# Altium schematic sheet FMTrans.SchDoc
size A3; SheetNumber: 1; SheetTotal: 1
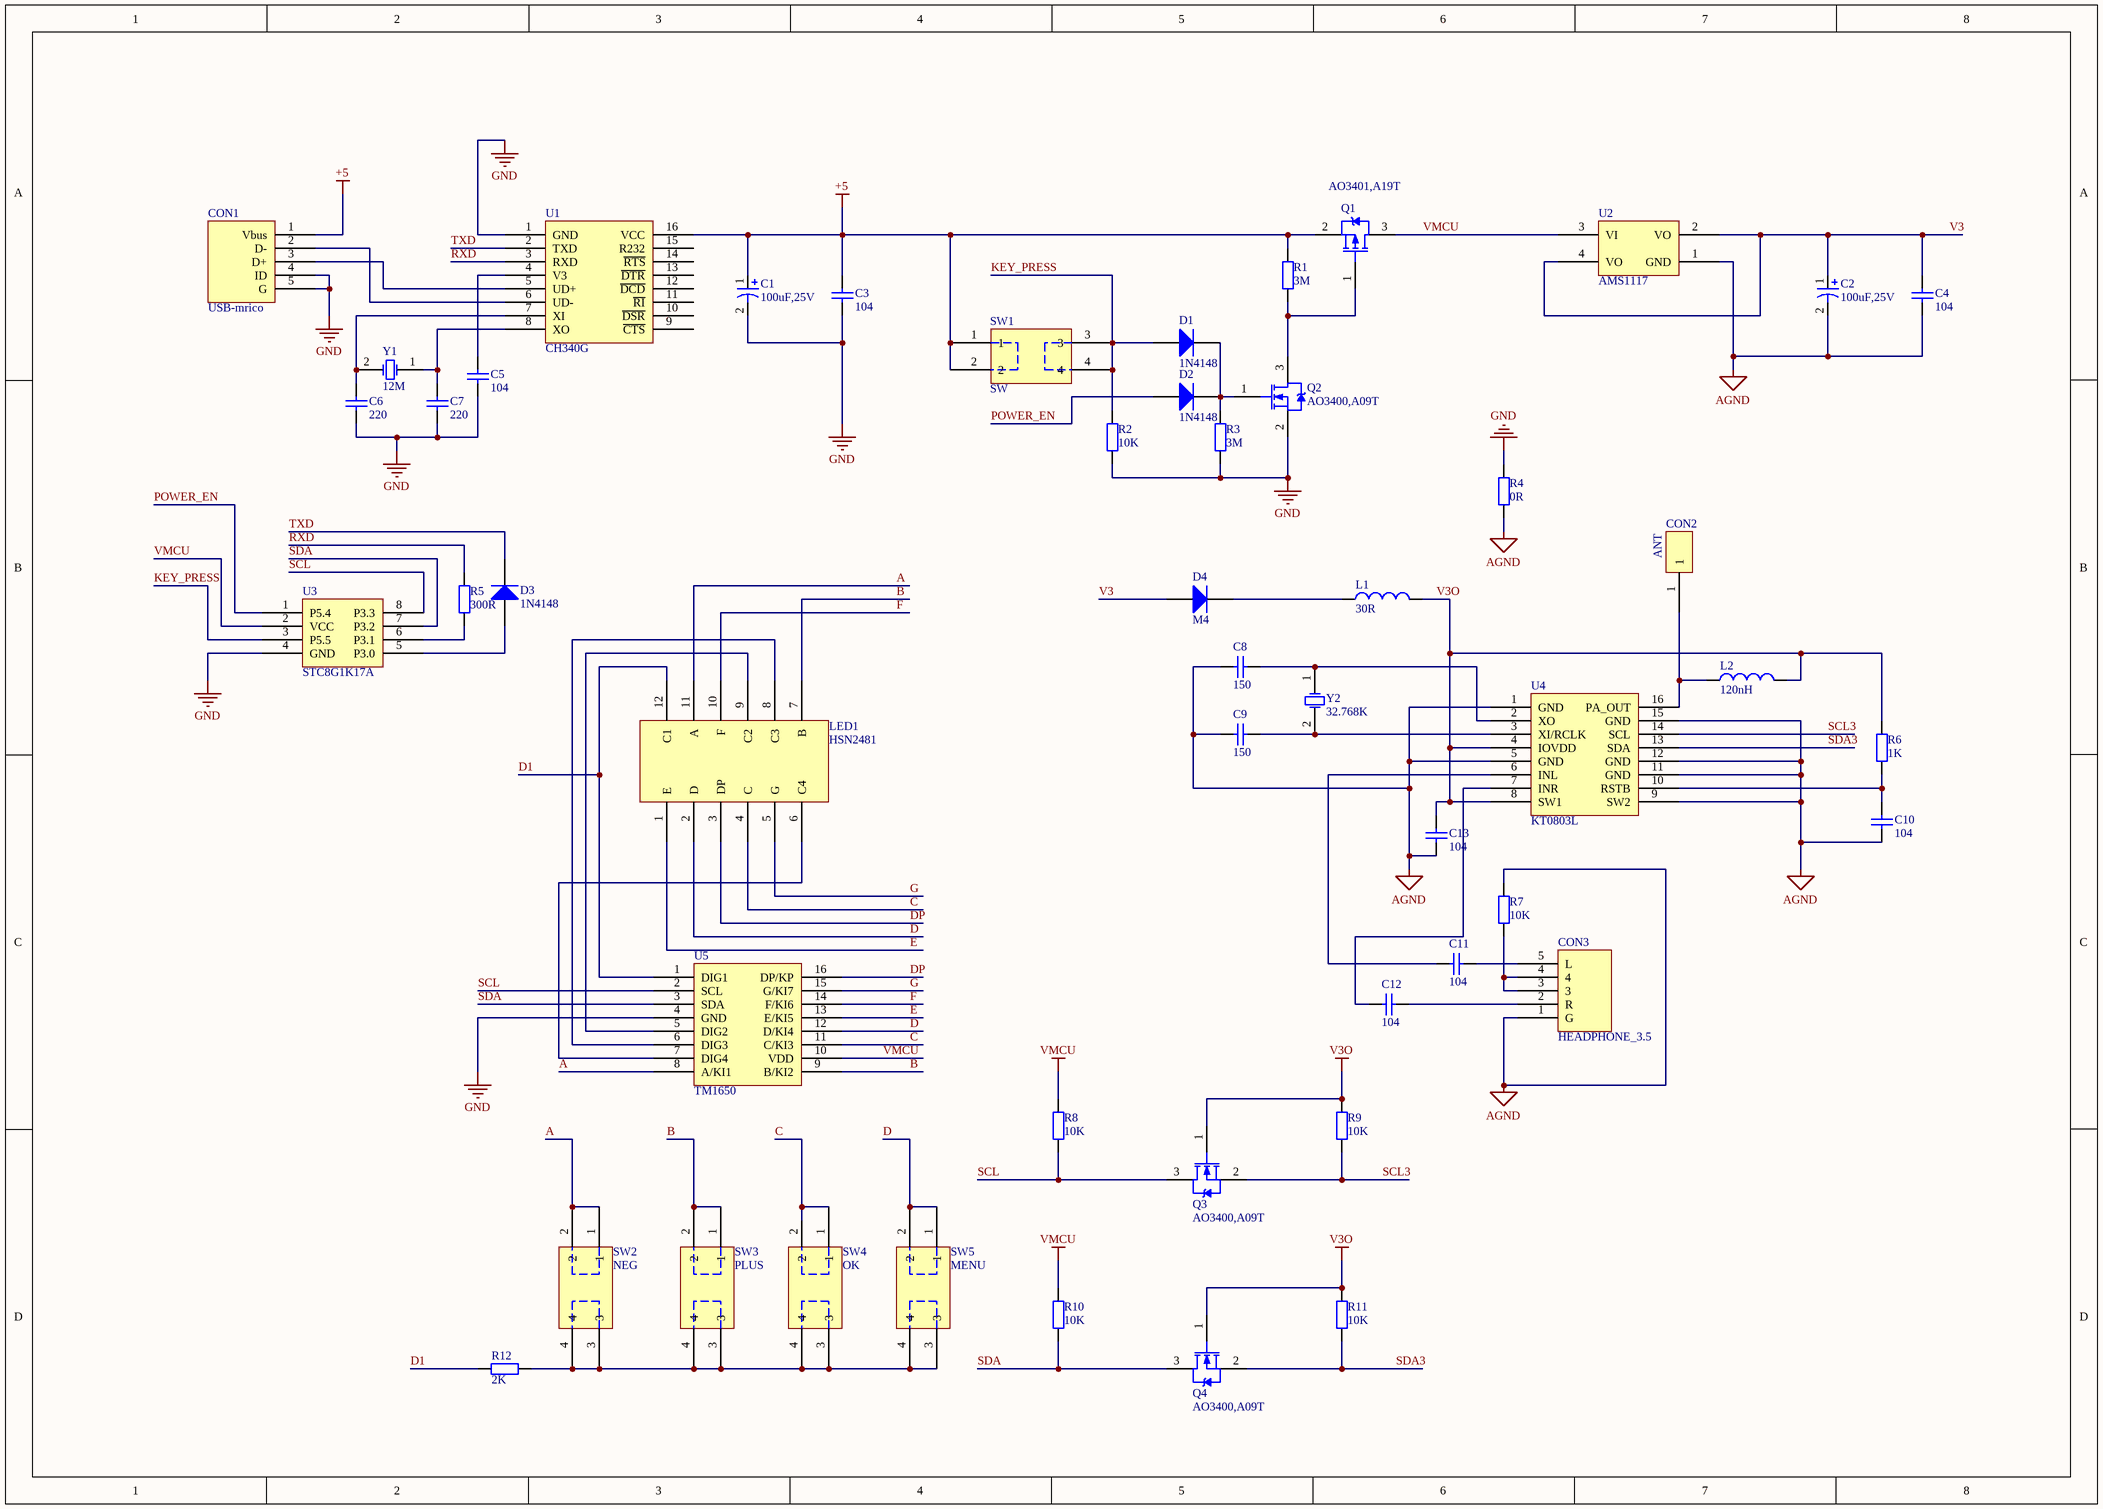
[diagram p0: FMTrans.SchDoc]

## Parts
C1  value 100uF,25V  [SMD-EC-F6.3]  (hidden comment: Cap Pol1)
C2  value 100uF,25V  [SMD-EC-F6.3]  (hidden comment: Cap Pol1)
C3  value 104  [CAPC1608L]  (hidden comment: Cap)
C4  value 104  [CAPC1608L]  (hidden comment: Cap)
C5  value 104  [CAPC1608L]  (hidden comment: Cap)
C6  value 220  [CAPC1608L]  (hidden comment: Cap)
C7  value 220  [CAPC1608L]  (hidden comment: Cap)
C8  value 150  [CAPC1608L]  (hidden comment: Cap)
C9  value 150  [CAPC1608L]  (hidden comment: Cap)
C10  value 104  [CAPC1608L]  (hidden comment: Cap)
C11  value 104  [CAPC1608L]  (hidden comment: Cap)
C12  value 104  [CAPC1608L]  (hidden comment: Cap)
C13  value 104  [CAPC1608L]  (hidden comment: Cap)
CON1  USB-mrico  [USB-micro_B]
CON2  ANT  [ANT]
CON3  HEADPHONE_3.5  [3F07]
D1  1N4148  [CD3216-1206]
D2  1N4148  [CD3216-1206]
D3  1N4148  [CD3216-1206]
D4  M4  [CD3216-1206]
L1  value 30R  [RESC2012L]  (hidden comment: Inductor)
L2  value 120nH  [RESC2012L]  (hidden comment: Inductor)
LED1  HSN2481  [HSN2481]
Q1  AO3401,A19T  [SOT-23B_L]
Q2  AO3400,A09T  [SOT-23B_L]
Q3  AO3400,A09T  [SOT-23B_L]
Q4  AO3400,A09T  [SOT-23B_L]
R1  value 3M  [RESC1608L]  (hidden comment: Res2)
R2  value 10K  [RESC1608L]  (hidden comment: Res2)
R3  value 3M  [RESC1608L]  (hidden comment: Res2)
R4  value 0R  [RESC1608L]  (hidden comment: Res2)
R5  value 300R  [RESC1608L]  (hidden comment: Res2)
R6  value 1K  [RESC1608L]  (hidden comment: Res2)
R7  value 10K  [RESC1608L]  (hidden comment: Res2)
R8  value 10K  [RESC1608L]  (hidden comment: Res2)
R9  value 10K  [RESC1608L]  (hidden comment: Res2)
R10  value 10K  [RESC1608L]  (hidden comment: Res2)
R11  value 10K  [RESC1608L]  (hidden comment: Res2)
R12  value 2K  [RESC1608L]  (hidden comment: Res2)
SW1  SW  [SW/PB-V4/H7.1]
SW2  NEG  [SW/PB-V4/H7.1]
SW3  PLUS  [SW/PB-V4/H7.1]
SW4  OK  [SW/PB-V4/H7.1]
SW5  MENU  [SW/PB-V4/H7.1]
U1  CH340G  [SOP127P762-16L]
U2  AMS1117  [SOT223-4M]
U3  STC8G1K17A  [DIP-8]
U4  KT0803L  [SOP127P762-16L]
U5  TM1650  [SOP127P762-16L]
Y1  12M  [XTAL-5032]
Y2  32.768K  [XTAL-3215]

## Nets
+5: C1.1 C3.2 CON1.1(Vbus) Q1.2(S) R1.2 SW1.1 SW1.2 U1.16(VCC)
AGND: C2.2 C4.1 C8.1 C9.1 C10.2 C13.1 CON3.1(G) R4.1 R7.2 U2.1(GND) U4.1(GND) U4.5(GND) U4.9(SW2) U4.11(GND) U4.12(GND) U4.15(GND)
GND: C1.2 C3.1 C5.1 C6.1 C7.1 CON1.4(ID) CON1.5(G) Q2.2(S) R2.1 R3.1 R4.2 U1.1(GND) U3.4(GND) U5.4(GND)
V3O: C13.2 L1.2 L2.2 Q3.1(G) Q4.1(G) R6.2 R9.2 R11.2 U4.4(IOVDD) U4.8(SW1)
VMCU: Q1.3(D) R8.2 R10.2 U2.3(VI) U3.2(VCC) U5.10(VDD)
A: LED1.11(A) SW2.1 SW2.2 U5.8(A/KI1)
B: LED1.7(B) SW3.1 SW3.2 U5.9(B/KI2)
C: LED1.4(C) SW4.1 SW4.2 U5.11(C/KI3)
D: LED1.2(D) SW5.1 SW5.2 U5.12(D/KI4)
D1: LED1.12(C1) R12.2 U5.1(DIG1)
DP: LED1.3(DP) U5.16(DP/KP)
E: LED1.1(E) U5.13(E/KI5)
F: LED1.10(F) U5.14(F/KI6)
G: LED1.5(G) U5.15(G/KI7)
KEY_PRESS: D1.1(A) R2.2 SW1.3 SW1.4 U3.3(P5.5)
POWER_EN: D2.1(A) U3.1(P5.4)
RXD: R5.2 U1.3(RXD)
SCL: Q3.3(D) R8.1 U3.8(P3.3) U5.2(SCL)
SCL3: Q3.2(S) R9.1 U4.14(SCL)
SDA: Q4.3(D) R10.1 U3.7(P3.2) U5.3(SDA)
SDA3: Q4.2(S) R11.1 U4.13(SDA)
TXD: D3.2(K) U1.2(TXD)
V3: C2.1 C4.2 D4.1(A) U2.2(VO) U2.4(VO)
NetC5_2: C5.2 U1.4(V3)
NetC6_2: C6.2 U1.7(XI) Y1.2(OSC2)
NetC7_2: C7.2 U1.8(XO) Y1.1(OSC1)
NetC8_2: C8.2 U4.2(XO) Y2.1(OSC1)
NetC9_2: C9.2 U4.3(XI/RCLK) Y2.2(OSC2)
NetC10_1: C10.1 R6.1 U4.10(RSTB)
NetC11_1: C11.1 CON3.5(L)
NetC11_2: C11.2 U4.6(INL)
NetC12_1: C12.1 CON3.2(R)
NetC12_2: C12.2 U4.7(INR)
NetCON1_2: CON1.2(D-) U1.6(UD-)
NetCON1_3: CON1.3(D+) U1.5(UD+)
NetCON2_1: CON2.1 L2.1 U4.16(PA_OUT)
NetCON3_3: CON3.3 CON3.4 R7.1
NetD1_2: D1.2(K) D2.2(K) Q2.1(G) R3.2
NetD3_1: D3.1(A) U3.5(P3.0)
NetD4_2: D4.2(K) L1.1
NetLED1_6: LED1.6(C4) U5.7(DIG4)
NetLED1_8: LED1.8(C3) U5.6(DIG3)
NetLED1_9: LED1.9(C2) U5.5(DIG2)
NetQ1_1: Q1.1(G) Q2.3(D) R1.1
NetR5_1: R5.1 U3.6(P3.1)
NetR12_1: R12.1 SW2.3 SW2.4 SW3.3 SW3.4 SW4.3 SW4.4 SW5.3 SW5.4

Not connected (* = marked no-connect by the designer): U1 9(~{CTS}) 10(~{DSR}) 11(~{RI}) 12(~{DCD}) 13(~{DTR}) 14(~{RTS}) 15(R232)

## Library data of the parts
C1 C2 = Cap Pol1: Polarized Capacitor (Radial); Published: 8-Jun-2000; LatestRevisionDate: 17-Jul-2002; LatestRevisionNote: Re-released for DXP Platform.; PackageReference: RB7.6-15; Publisher: Altium Limited; PackageDescription: Polarized Capacitor (Radial); 2 Leads
C3-C13 = Cap: Capacitor; Published: 8-Jun-2000; LatestRevisionDate: 17-Jul-2002; LatestRevisionNote: Re-released for DXP Platform.; PackageReference: RAD-0.3; Publisher: Altium Limited; PackageDescription: Radial Cap, Thru-Hole; 2 Leads; 0.3 in Pin Spacing
CON1 = USB_MICRO_B
D1-D3 = Diode: Published: 8-Jun-2000; LatestRevisionDate: 17-Jul-2002; LatestRevisionNote: Re-released for DXP Platform.; PackageVersion: Sep-1996; PackageReference: SMC; Publisher: Altium Limited; PackageDescription: DO-214-AB/SMC; 2 C-Bend Leads; Body 7.9 x 5.9 mm, inc. leads (LxW); Code_JEDEC: DO-214-AB
D4 = Diode: 1N4148; Published: 8-Jun-2000; LatestRevisionDate: 17-Jul-2002; LatestRevisionNote: Re-released for DXP Platform.; PackageVersion: Sep-1996; PackageReference: SMC; Publisher: Altium Limited; PackageDescription: DO-214-AB/SMC; 2 C-Bend Leads; Body 7.9 x 5.9 mm, inc. leads (LxW); Code_JEDEC: DO-214-AB
L1 L2 = Inductor: Code_IEC: 1005; Published: 8-Jun-2000; LatestRevisionDate: 29-May-2009; LatestRevisionNote: IPC-7351 Footprint Added.; PackageReference: 0402-A; Publisher: Altium Limited; PackageDescription: Chip Inductor; Code_JEITA: 0402
Q1 = PMOS-2: P-Channel Power MOSFET; Note: Pin 4 not drawn and electrically connected to Pin 2.; Published: 8-Jun-2000; LatestRevisionDate: 17-Jul-2002; LatestRevisionNote: Re-released for DXP Platform.; DatasheetVersion: PD-9.390D; PackageVersion: Feb-1997; PackageReference: TO-220AB; Publisher: Altium Limited; PackageDescription: TO, Thru-Hole, Vertical, Heatsink Mounted; 3 In-Line Leads; Pitch 2.54 mm; ComponentLink1Description: Manufacturer Link; ComponentLink1URL: http://www.irf.com/
Q2-Q4 = NMOS-2: N-Channel Power MOSFET; Note: Pin 2 is electrically connected to pin 4.; Published: 8-Jun-2000; LatestRevisionDate: 17-Jul-2002; LatestRevisionNote: Re-released for DXP Platform.; DatasheetVersion: PD-9.814; PackageVersion: Feb-1997; PackageReference: TO-220AB; Publisher: Altium Limited; PackageDescription: TO, Thru-Hole, Vertical, Heatsink Mounted; 3 In-Line Leads; Pitch 2.54 mm; ComponentLink1Description: Manufacturer Link; ComponentLink1URL: http://www.irf.com/
R1-R12 = Res2: Resistor; Published: 8-Jun-2000; LatestRevisionDate: 17-Jul-2002; LatestRevisionNote: Re-released for DXP Platform.; PackageReference: AXIAL-0.4; Publisher: Altium Limited; PackageDescription: Axial Device, Thru-Hole; 2 Leads; 0.4 in Pin Spacing
SW2-SW5 = SW
Y1 Y2 = XTAL: Crystal Oscillator; Published: 8-Jun-2000; LatestRevisionDate: 17-Jul-2002; LatestRevisionNote: Re-released for DXP Platform.; PackageReference: R38; Publisher: Altium Limited; PackageDescription: Crystal, Thru-Hole; 2 Leads; Body 3.1 x 8.2 mm (Dia.xH)